# EAGLE design relaxbox (EAGLE 6.4)
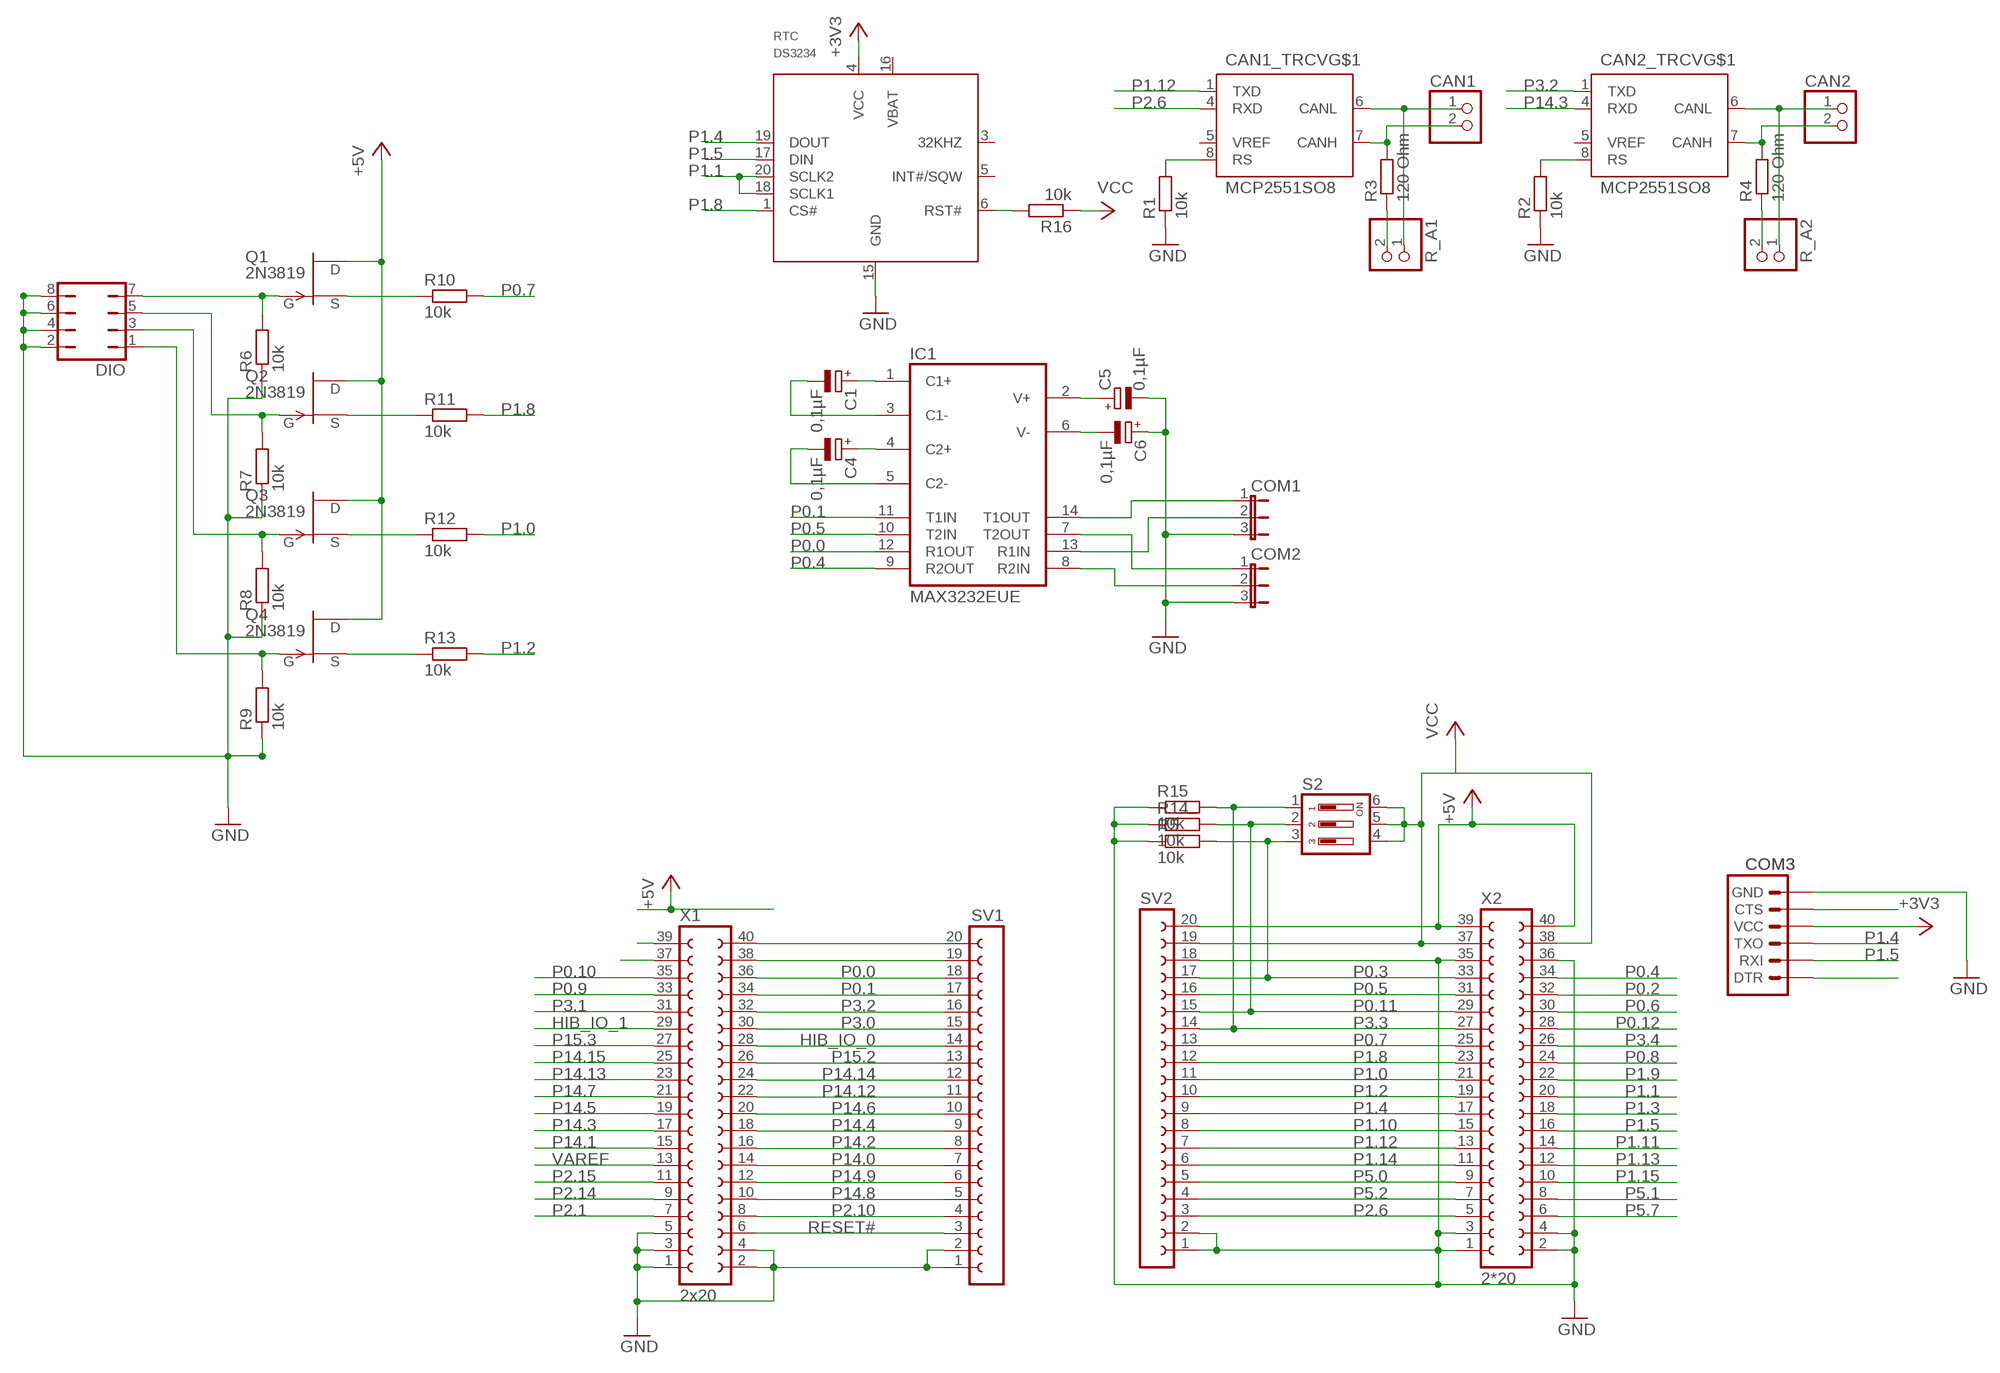
[diagram p0: schematic, sheet 1]

## Parts
C1  0,1µF  CPOL-EUE2.5-5  [E2,5-5]
C4  0,1µF  CPOL-EUE2.5-5  [E2,5-5]
C5  0,1µF  CPOL-EUE2.5-5  [E2,5-5]
C6  0,1µF  CPOL-EUE2.5-5  [E2,5-5]
CAN1  PINHD-1X2  [1X02]
CAN1_TRCV  MCP2551SO8  [SO08]
CAN2  PINHD-1X2  [1X02]
CAN2_TRCV  MCP2551SO8  [SO08]
COM1  JP2E  [JP2]
COM2  JP2E  [JP2]
COM3  SPARKFUN_ARDUINO_SERIAL_PROGRAMPTH  [SPARKFUN_1X06]
DIO  JP4Q  [JP4Q]
IC1  MAX3232EUE  [TSSOP16]
Q1  2N3819  [TO92]
Q2  2N3819  [TO92]
Q3  2N3819  [TO92]
Q4  2N3819  [TO92]
R1  10k  R-EU_M0805  [M0805]
R2  10k  R-EU_M0805  [M0805]
R3  120 Ohm  R-EU_M0805  [M0805]
R4  120 Ohm  R-EU_M0805  [M0805]
R5  10k  R-EU_M0805  [M0805]
R6  10k  R-EU_M0805  [M0805]
R7  10k  R-EU_M0805  [M0805]
R8  10k  R-EU_M0805  [M0805]
R9  10k  R-EU_M0805  [M0805]
R10  10k  R-EU_M0805  [M0805]
R11  10k  R-EU_M0805  [M0805]
R12  10k  R-EU_M0805  [M0805]
R13  10k  R-EU_M0805  [M0805]
R14  10k  R-EU_M0805  [M0805]
R15  10k  R-EU_M0805  [M0805]
R16  10k  R-EU_M0805  [M0805]
R_A1  PINHD-1X2  [1X02]
R_A2  PINHD-1X2  [1X02]
RTC  DS3234  [SO-20DW]
S2  DIP03YL  [DIP03YL]
SV1  FE20-1  [FE20]
SV2  FE20-1  [FE20]
X1  2x20  FE20-2  [FE20-2]
X2  2*20  FE20-2  [FE20-2]

## Nets
+3V3: COM3.4(VCC) RTC.4(VCC)
+5V: Q1.1(D) Q2.1(D) Q3.1(D) Q4.1(D) SV2.20 X2.39 X2.40
CANH1: CAN1.2 CAN1_TRCV.7(CANH) R3.2
CANH2: CAN2.2 CAN2_TRCV.7(CANH) R4.2
CANL1: CAN1.1 CAN1_TRCV.6(CANL) R_A1.1
CANL2: CAN2.1 CAN2_TRCV.6(CANL) R_A2.1
GND: C5.- C6.+ COM1.3 COM2.3 COM3.6(GND) DIO.2 DIO.4 DIO.6 DIO.8 R1.1 R2.1 R5.1 R6.1 R7.1 R8.1 R9.1 R14.1 R15.1 RTC.15(GND) SV1.1 SV1.2 SV2.1 SV2.2 SV2.18 X1.1 X1.2 X1.3 X1.4 X1.5 X2.1 X2.2 X2.3 X2.4 X2.35 X2.36
HIB_IO_0: SV1.14 X1.28
HIB_IO_1: X1.29
N$1: X1.39
N$2: SV1.20 X1.40
N$3: SV1.19 X1.38
N$4: X1.37
N$5: C1.+ IC1.1(C1+)
N$6: C1.- IC1.3(C1-)
N$7: COM3.5(CTS)
N$8: R16.2 RTC.6(RST#)
N$10: COM3.1(DTR)
N$11: C4.+ IC1.4(C2+)
N$12: C4.- IC1.5(C2-)
N$13: CAN1_TRCV.8(RS) R1.2
N$14: CAN2_TRCV.8(RS) R2.2
N$15: C5.+ IC1.2(V+)
N$16: C6.- IC1.6(V-)
N$19: R3.1 R_A1.2
N$20: R4.1 R_A2.2
N$25: DIO.7 Q1.2(G) R6.2
N$26: Q1.3(S) R10.1
N$28: DIO.1 Q4.2(G) R9.2
N$29: DIO.3 Q3.2(G) R8.2
N$30: DIO.5 Q2.2(G) R7.2
N$31: Q2.3(S) R11.1
N$33: Q3.3(S) R12.1
N$35: Q4.3(S) R13.1
N$37: COM1.1 IC1.14(T1OUT)
N$38: COM1.2 IC1.13(R1IN)
N$39: COM2.1 IC1.7(T2OUT)
N$40: COM2.2 IC1.8(R2IN)
P0.0: IC1.12(R1OUT) SV1.18 X1.36
P0.1: IC1.11(T1IN) SV1.17 X1.34
P0.2: X2.32
P0.3: R5.2 S2.3 SV2.17 X2.33
P0.4: IC1.9(R2OUT) X2.34
P0.5: IC1.10(T2IN) SV2.16 X2.31
P0.6: X2.30
P0.7: R10.2 SV2.13 X2.25
P0.8: X2.24
P0.9: X1.33
P0.10: X1.35
P0.11: R14.2 S2.2 SV2.15 X2.29
P0.12: X2.28
P1.0: R12.2 SV2.11 X2.21
P1.1: RTC.18(SCLK1) RTC.20(SCLK2) X2.20
P1.2: R13.2 SV2.10 X2.19
P1.3: X2.18
P1.4: COM3.3(TXO) RTC.19(DOUT) SV2.9 X2.17
P1.5: COM3.2(RXI) RTC.17(DIN) X2.16
P1.8: R11.2 RTC.1(CS#) SV2.12 X2.23
P1.9: X2.22
P1.10: SV2.8 X2.15
P1.11: X2.14
P1.12: CAN1_TRCV.1(TXD) SV2.7 X2.13
P1.13: X2.12
P1.14: SV2.6 X2.11
P1.15: X2.10
P2.1: X1.7
P2.6: CAN1_TRCV.4(RXD) SV2.3 X2.5
P2.10: SV1.4 X1.8
P2.14: X1.9
P2.15: X1.11
P3.0: SV1.15 X1.30
P3.1: X1.31
P3.2: CAN2_TRCV.1(TXD) SV1.16 X1.32
P3.3: R15.2 S2.1 SV2.14 X2.27
P3.4: X2.26
P5.0: SV2.5 X2.9
P5.1: X2.8
P5.2: SV2.4 X2.7
P5.7: X2.6
P14.0: SV1.7 X1.14
P14.1: X1.15
P14.2: SV1.8 X1.16
P14.3: CAN2_TRCV.4(RXD) X1.17
P14.4: SV1.9 X1.18
P14.5: X1.19
P14.6: SV1.10 X1.20
P14.7: X1.21
P14.8: SV1.5 X1.10
P14.9: SV1.6 X1.12
P14.12: SV1.11 X1.22
P14.13: X1.23
P14.14: SV1.12 X1.24
P14.15: X1.25
P15.2: SV1.13 X1.26
P15.3: X1.27
RESET#: SV1.3 X1.6
VAREF: X1.13
VCC: R16.1 S2.4 S2.5 S2.6 SV2.19 X2.37 X2.38
Unconnected: CAN1_TRCV.5(VREF) CAN2_TRCV.5(VREF) RTC.3(32KHZ) RTC.5(INT#/SQW) RTC.16(VBAT)

## Power pins joined to a net without a drawn wire
GND: CAN1_TRCV.2(GND) CAN2_TRCV.2(GND) IC1.15(GND)
VCC: CAN1_TRCV.3(VCC) CAN2_TRCV.3(VCC) IC1.16(VCC)

## Library data of the parts
C1 C4-C6 = rcl:CPOL-EU: POLARIZED CAPACITOR, European symbol
CAN1 CAN2 R_A1 R_A2 = pinhead:PINHD-1X2: PIN HEADER
CAN1_TRCV CAN2_TRCV = can:MCP2551: CAN Tranceiver Microchip
COM1 COM2 = jumper:JP2E: JUMPER
COM3 = ArduinoBluetoothMatev13:SPARKFUN_ARDUINO_SERIAL_PROGRAM
DIO = jumper:JP4Q: JUMPER
IC1 = maxim:MAX3232*: True RS-232 Transceivers 3.0V to 5.5V, Low-Power up to 1Mbps, Using Four 0.1µF External Capacitors Source: http://pdfserv.maxim-ic.com/en/ds/MAX3222-MAX3241.pdf; MF: MAXIM; MPN: MAX3232EUE+; OC_FARNELL: 1379769; OC_NEWARK: 68K4632
Q1-Q4 = transistor-fet:2N3819: N-Channel Junction FET
R1-R16 = rcl:R-EU_: RESISTOR, European symbol
RTC = ds3234:DS3234*: Extremely Accurate SPI Bus RTC with Integrated Crystal and SRAM The DS3234 is a low-cost, extremely accurate SPI? bus real-time clock (RTC) with an integrated temperature-com- pensated crystal oscillator (TCXO) and crystal. The DS3234 incorporates a precision, temperature-compen- sated voltage reference and comparator circuit to monitor VCC. When VCCdrops below the power-fail voltage (VPF), the device asserts the RSToutput and also disables read and write access to the part when VCCdrops below both VPFand VBAT. The RSTpin is monitored as a pushbutton input for generating a µP reset. The device switches to the backup supply input and maintains accurate timekeeping when main power to the device is interrupted. The integra- tion of the crystal resonator enhances the long-term accu- racy of the device as well as reduces the piece-part count in a manufacturing line. The DS3234 is available in com- mercial and industrial temperature ranges, and is offered in an industry-standard 300-mil, 20-pin SO package. The DS3234 also integrates 256 bytes of battery-backed SRAM. In the event of main power loss, the contents of the memory are maintained by the power source con- nected to the VBATpin. The RTC maintains seconds, minutes, hours, day, date, month, and year information. The date at the end of the month is automatically adjust- ed for months with fewer than 31 days, including correc- tions for leap year. The clock operates in either the 24-hour or 12-hour format with AM/PM indicator. Two programmable time-of-day alarms and a programmable square-wave output are provided. Address and data are transferred serially by an SPI bidirectional bus. Accuracy ±2ppm from 0°C to +40°C Accuracy ±3.5ppm from -40°C to +85°C Battery Backup Input for Continuous Timekeeping Operating Temperature Ranges Commercial: 0°C to +70°C Industrial: -40°C to +85°C Low-Power Consumption Real-Time Clock Counts Seconds, Minutes, Hours, Day, Date, Month, and Year with Leap Year Compensation Valid Up to 2099 Two Time-of-Day Alarms Programmable Square-Wave Output 4MHz SPI Bus Supports Modes 1 and 3 Digital Temp Sensor Output: ±3°C Accuracy Register for Aging Trim RSTInput/Output 300-Mil, 20-Pin SO Package Underwriters Laboratories (UL®) Recognized
S2 = switch-dil:DIP03YL: DIL/CODE SWITCH; OC_FARNELL: unknown; OC_NEWARK: unknown
SV1 SV2 = con-lsta:FE20-1: FEMALE HEADER; OC_FARNELL: unknown; OC_NEWARK: unknown
X1 X2 = con-lsta:FE20-2: FEMALE HEADER; OC_FARNELL: unknown; OC_NEWARK: unknown

## Board
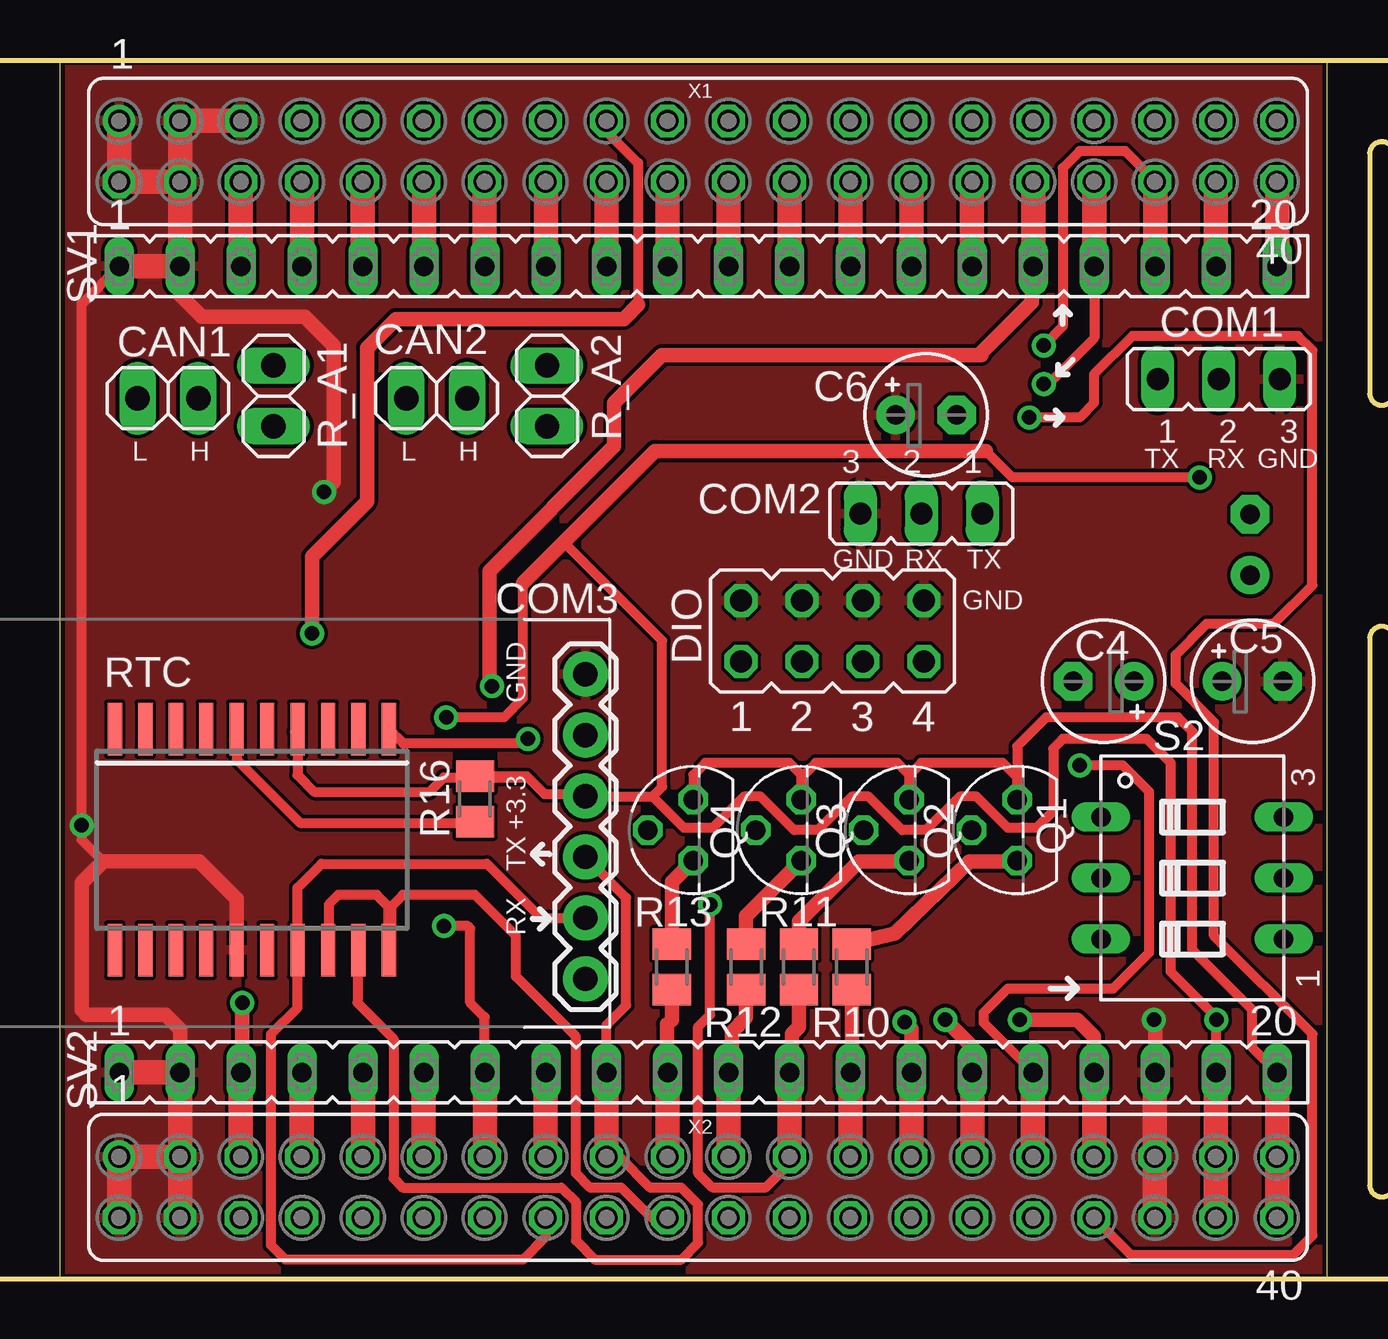
[diagram p1: board, top side]
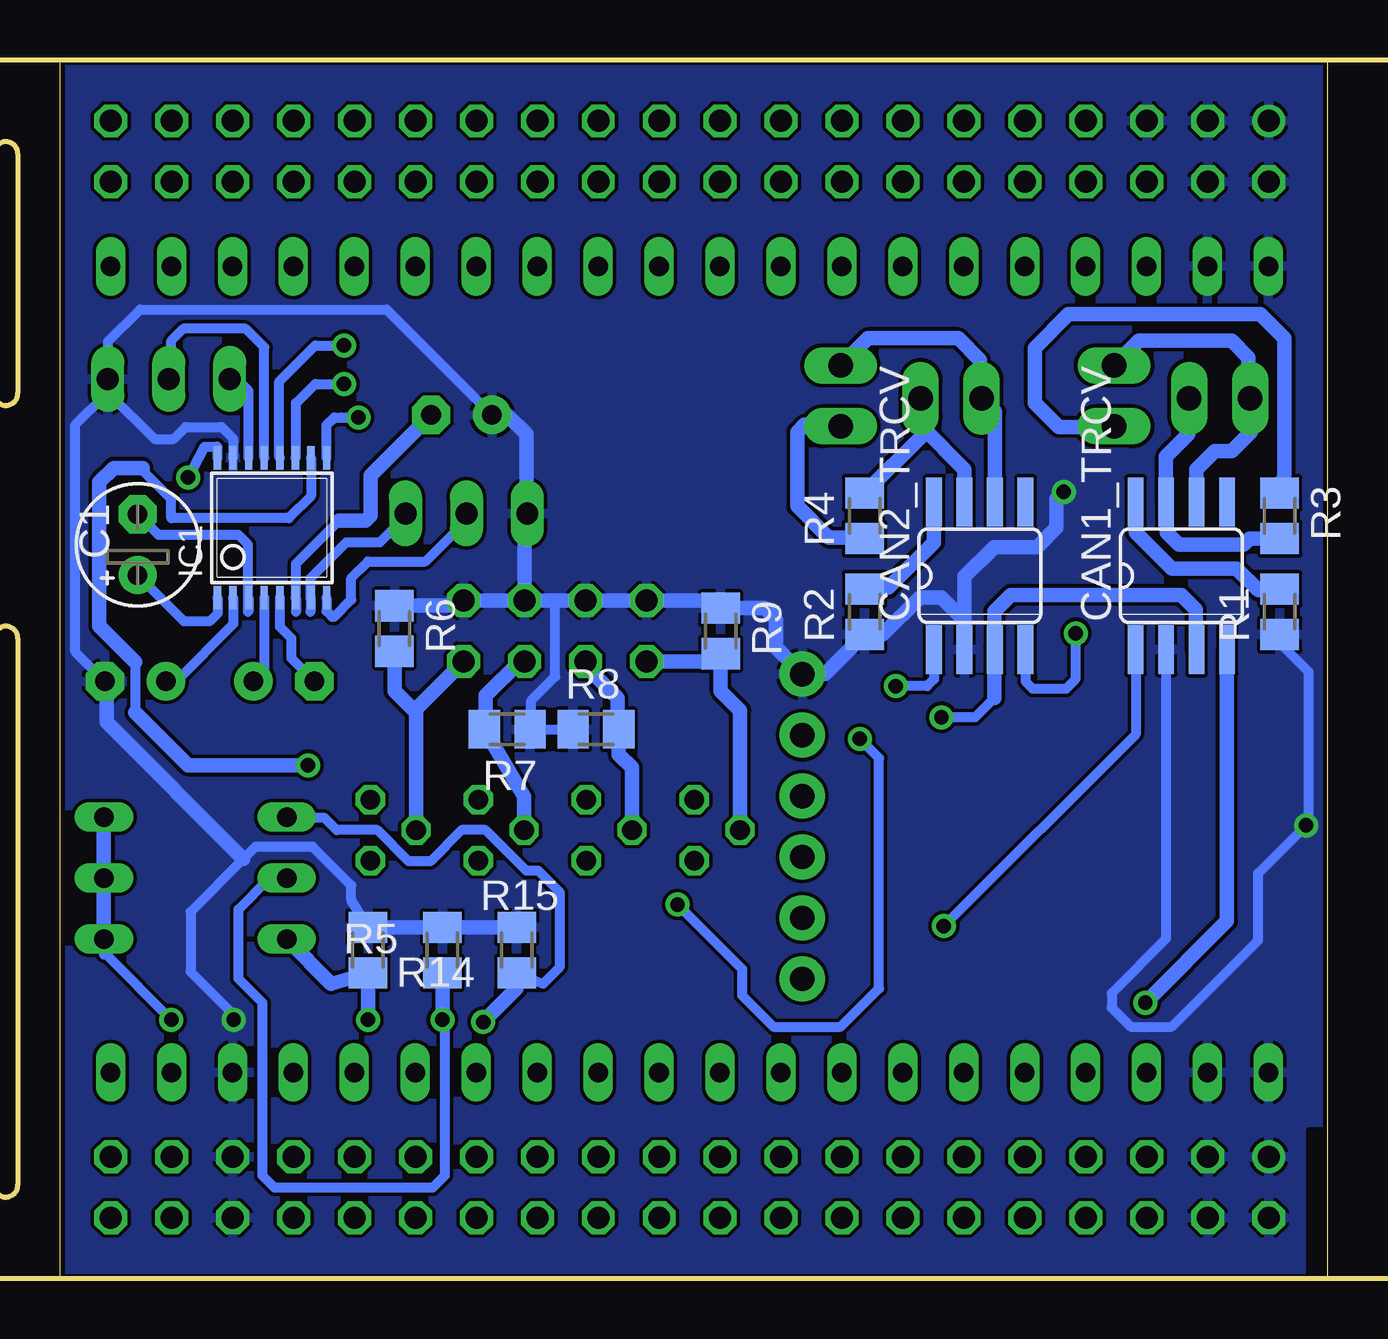
[diagram p2: board, bottom side, seen from below]

Size 52.82 x 50.8 mm. Coordinates in mm from the lower left corner, seen from the top.
Outline: 0,0 52.82,0 52.82,50.8 0,50.8 0,0
Copper layers (1*16): Top 0.035mm / dielectric 1.5mm / Bottom 0.035mm
Design rules "platinensammler_02": minimum track width 0.15mm, minimum drill 0.3mm, track to track 0.15mm, track to pad 0.15mm, pad to pad 0.15mm, via to via 0.15mm, smd to smd 0mil, copper to edge 0.2mm, drill to drill 0.2mm, minimum pad ring 0.2mm, minimum via ring 0.2mm, stop-mask expansion 4mil, vias tented up to drill 0.8mm, thermal gap 0.15mm
tRestrict: 4 lines
bRestrict: 6 lines
Milling: 12 lines

### Footprints (pad centres in the part's own frame; a part is rotated, then mirrored left to right if it is on the bottom)
E2,5-5 = drill 0.813 pad 1.6: + -1.27,0 | drill 0.813 pad 1.6 octagon: - 1.27,0
1X02 = drill 1.016 long: 1 -1.27,0; 2 1.27,0
SO08 = smd 0.66 x 2.032: 1 -1.905,-3.073; 2 -0.635,-3.073; 3 0.635,-3.073; 4 1.905,-3.073; 5 1.905,3.073; 6 0.635,3.073; 7 -0.635,3.073; 8 -1.905,3.073
JP2 = drill 0.914 long: 1 -2.54,0; 2 0,0; 3 2.54,0
SPARKFUN_1X06 = drill 1.016 pad 1.88: 1 0,0; 2 2.54,0; 3 5.08,0; 4 7.62,0; 5 10.16,0; 6 12.7,0
JP4Q = drill 0.914 octagon: 1 -3.81,-1.27; 2 -3.81,1.27; 3 -1.27,-1.27; 4 -1.27,1.27; 5 1.27,-1.27; 6 1.27,1.27; 7 3.81,-1.27; 8 3.81,1.27
TSSOP16 = smd 0.305 x 0.991: 1 -2.275,-2.918; 2 -1.625,-2.918; 3 -0.975,-2.918; 4 -0.325,-2.918; 5 0.325,-2.918; 6 0.975,-2.918; 7 1.625,-2.918; 8 2.275,-2.918; 9 2.275,2.918; 10 1.625,2.918; 11 0.975,2.918; 12 0.325,2.918; 13 -0.325,2.918; 14 -0.975,2.918; 15 -1.625,2.918; 16 -2.275,2.918
TO92 = drill 0.813 octagon: 1 1.27,0; 2 0,1.905; 3 -1.27,0
M0805 = smd 1.3 x 1.6: 1 -0.95,0; 2 0.95,0
SO-20DW = smd 0.6 x 2.2: 1 -5.715,-4.6; 2 -4.445,-4.6; 3 -3.175,-4.6; 4 -1.905,-4.6; 5 -0.635,-4.6; 6 0.635,-4.6; 7 1.905,-4.6; 8 3.175,-4.6; 9 4.445,-4.6; 10 5.715,-4.6; 11 5.715,4.6; 12 4.445,4.6; 13 3.175,4.6; 14 1.905,4.6; 15 0.635,4.6; 16 -0.635,4.6; 17 -1.905,4.6; 18 -3.175,4.6; 19 -4.445,4.6; 20 -5.715,4.6
DIP03YL = drill 0.813 long: 1 -2.54,-3.81; 2 0,-3.81; 3 2.54,-3.81; 4 2.54,3.81; 5 0,3.81; 6 -2.54,3.81
FE20 = drill 0.813 long: 1 -24.13,0; 2 -21.59,0; 3 -19.05,0; 4 -16.51,0; 5 -13.97,0; 6 -11.43,0; 7 -8.89,0; 8 -6.35,0; 9 -3.81,0; 10 -1.27,0; 11 1.27,0; 12 3.81,0; 13 6.35,0; 14 8.89,0; 15 11.43,0; 16 13.97,0; 17 16.51,0; 18 19.05,0; 19 21.59,0; 20 24.13,0
FE20-2 = drill 0.914: 1 -24.13,1.27 | drill 0.914 octagon: 2 -24.13,-1.27; 3 -21.59,1.27; 4 -21.59,-1.27; 5 -19.05,1.27; 6 -19.05,-1.27; 7 -16.51,1.27; 8 -16.51,-1.27; 9 -13.97,1.27; 10 -13.97,-1.27; 11 -11.43,1.27; 12 -11.43,-1.27; 13 -8.89,1.27; 14 -8.89,-1.27; 15 -6.35,1.27; 16 -6.35,-1.27; 17 -3.81,1.27; 18 -3.81,-1.27; 19 -1.27,1.27; 20 -1.27,-1.27; 21 1.27,1.27; 22 1.27,-1.27; 23 3.81,1.27; 24 3.81,-1.27; 25 6.35,1.27; 26 6.35,-1.27; 27 8.89,1.27; 28 8.89,-1.27; 29 11.43,1.27; 30 11.43,-1.27; 31 13.97,1.27; 32 13.97,-1.27; 33 16.51,1.27; 34 16.51,-1.27; 35 19.05,1.27; 36 19.05,-1.27; 37 21.59,1.27; 38 21.59,-1.27; 39 24.13,1.27; 40 24.13,-1.27

### Placement (x,y rotation side)
C1  49.6,30.6 90 bottom
C4  43.5,24.9 180 top
C5  49.7,24.9 0 top
C6  36.1,36 0 top
CAN1  4.5,36.7 0 top
CAN1_TRCV  6.1,29.3 0 bottom
CAN2  15.7,36.7 0 top
CAN2_TRCV  14.5,29.3 0 bottom
COM1  48.3,37.5 0 top
COM2  35.9,31.9 180 top
COM3  21.9,12.5 90 top
DIO  32.2,27 0 top
IC1  44,31.3 0 bottom
Q1  39.9,18.7 90 top
Q2  35.4,18.7 90 top
Q3  30.9,18.7 90 top
Q4  26.4,18.7 90 top
R1  2,27.8 90 bottom
R2  19.3,27.8 90 bottom
R3  2,31.8 270 bottom
R4  19.3,31.8 90 bottom
R5  40,13.7 270 bottom
R6  38.9,27.1 270 bottom
R7  34.2,22.9 180 bottom
R8  30.5,22.9 0 bottom
R9  25.3,27 270 bottom
R10  33,13 270 top
R11  30.8,13 270 top
R12  28.6,13 270 top
R13  25.5,13 270 top
R14  36.9,13.7 270 bottom
R15  33.8,13.7 270 bottom
R16  17.3,20 270 top
R_A1  8.9,36.8 270 top
R_A2  20.3,36.8 270 top
RTC  8,18.3 180 top
S2  47.2,16.7 270 top
SV1  26.6,42.2 0 top
SV2  26.6,8.6 0 top
X1  26.59,46.99 0 top
X2  26.59,3.81 0 top

### Tracks (layer width: path | path; a pad name or v marks a point on that pad's centre or on a via)
+3V3
  Top 0.406: 9.8,22.8 RTC.4 9.91,21 10.6,20.3 15.4,20.3 16,20.9 19.4,20.9 19.45,20.95 20.2,20.2 21.82,20.2 COM3.4 21.92,20.1
+5V
  Top 0.406: SV2.20 49.7,9.63 49.7,11.2 47.2,13.7 47.2,22.8 46.6,23.4 41.1,23.4 39.9,22.2 Q1.1 39.9,20.9 39.3,21.5 35.9,21.5 35.4,21 | Q2.1 35.4,21 | 35.4,21 34.9,21.5 31.5,21.5 30.9,20.9 | Q3.1 30.9,20.9 | 30.9,20.9 30.9,21 30.4,21.5 26.9,21.5 26.4,21 Q4.1
  Top 0.61: 40.23,19.97 Q1.1
  Top 1.016: SV2.20 X2.39 | X2.39 | X2.39 X2.40
CANH1
  Bottom 0.61: CAN1.2 5.8,36.67 5.8,35.2 6.74,34.27 CAN1_TRCV.7 6.7,32.34 6.7,31.1 6.2,30.6 3.5,30.6 3.25,30.85 R3.2
CANH2
  Bottom 0.61: CAN2_TRCV.7 15.13,33.73 16.9,35.5 | 16.9,35.5 16.9,36.63 CAN2.2 | 16.9,35.5 16.9,35.15 R4.2
CANL1
  Bottom 0.406: 3.3,36.77 CAN1.1
  Bottom 0.61: CAN1_TRCV.6 5.46,33.73 4.7,34.5 4,34.5 3.2,35.3 3.2,36.67 CAN1.1 | 3.3,36.77 3.3,38.4 4,39.1 7.87,39.1 R_A1.1
CANL2
  Bottom 0.406: 14.5,36.77 CAN2.1 14.4,36.67
  Bottom 0.61: 14.5,36.77 14.5,38.3 15.4,39.2 19.17,39.2 R_A2.1 | CAN2_TRCV.6 13.87,36.13 CAN2.1
GND  (via drill 0.6)
  Top 0.406: 45.65,10.75 v45.6,10.8 | SV2.2 | SV1.2 | 1.8,17.4 1.7,17.4 | 1.8,17.4 2,17.4 | 1.8,17.4 0.9,18.3 v0.9,18.9 0.9,40.63 SV1.1
  Top 0.61: SV2.18 45.65,10.75 | SV2.2 5,10.4 4.4,11 1.1,11 0.9,11.2 0.9,16.5 1.8,17.4 5.8,17.4 7.37,15.84 RTC.15 | SV1.2 5,41 5.9,40.1 10.2,40.1 11.4,38.9 11.4,33.2 v11,32.8
  Top 1.016: SV1.1 SV1.2 X1.4 | X1.4 X1.2 X1.1 | X1.4 X1.3 X1.5 | X2.3 X2.1 X2.2 | X2.3 X2.4 | X2.3 SV2.2 SV2.1 | X2.36 X2.35 SV2.18
  Bottom 0.406: CAN1_TRCV.2 6.8,26.16 | 33.4,31.94 COM2.3 33.47,31.79 | R8.1 R7.1 33.2,22.95 33.2,24.1 32.2,25.1 32.2,28.27 | 25.43,28.27 R9.1 | R5.1 40.7,15.8 40.7,16.4 42.3,18 44.7,18 45.2,17.5 47.4,15.3 47.4,12.8 45.6,11 v45.6,10.8 | C6.+ 39.23,40.4 49.5,40.4 50.84,39.06 COM1.3 50.8,37.46 50.8,36.9 | R2.1 18.55,26.85 | 15.2,27.5 15.2,26.29 CAN2_TRCV.2 | 6.8,26.29 CAN1_TRCV.2 | 2.35,26.85 R1.1 2,26.5 | 50.9,24.7 C5.- 52.2,26.13 52.2,35.6 50.9,36.9 50.8,36.9 | IC1.15 45.63,35.02 46.1,35.5 47.6,35.5 48.1,35 48.9,35 50.8,36.9 | 2,26.5 0.8,25.3 0.8,19 v0.9,18.9 2.9,16.9 2.9,14.1 6.5,10.5 8.2,10.5 9,11.3 9,11.9 6.74,14.16 CAN1_TRCV.2 | 2.45,26.85 2.35,26.85 | 2.35,26.85 2,26.5
  Bottom 0.61: C6.+ 34.2,36 33.4,35.2 33.4,31.94 | DIO.6 DIO.8 36.23,28.05 R6.1 | DIO.6 32.2,28.27 DIO.4 DIO.2 25.43,28.27 | R15.1 R14.1 R5.1 | DIO.6 33.47,31.79 | 18.55,26.85 17,28.4 16.1,28.4 15.2,27.5 | CAN2_TRCV.2 15.13,29.27 13.9,30.5 12.1,30.5 11.3,31.3 11.3,32.5 v11,32.8 | 50.9,24.7 50.9,23.2 45.2,17.5 | R2.1 20.95,25.2 COM3.6 23,26.3 23,27.5 23.45,27.95 R9.1
  pour Bottom: -0.1,50.9 -0.1,-0.3 53,-0.3 53,50.9
  pour Top: -0.1,50.9 -0.1,-0.3 53,-0.3 53,50.9
HIB_IO_0
  Top 1.016: SV1.14 X1.28
N$2
  Top 1.016: SV1.20 X1.40
N$3
  Top 1.016: X1.38 SV1.19
N$5
  Bottom 0.406: IC1.1 46.27,27.73 46.6,27.4 47.67,27.4 C1.+
N$6
  Bottom 0.406: IC1.3 44.98,27.82 45,27.8 45,30.6 45.4,31 48.73,31 C1.-
N$8
  Top 0.406: RTC.6 7.37,21.64 10,19 17.25,19 R16.2
N$11
  Bottom 0.406: IC1.4 44.32,25.34 C4.+
N$12
  Bottom 0.406: IC1.5 43.68,27.18 43.2,26.7 43.2,25.87 C4.-
N$13
  Bottom 0.406: R1.2 2.05,28.7 2.7,28.7 | 8.01,31.5 CAN1_TRCV.8
  Bottom 0.61: 2.7,28.7 2.9,28.7 3.8,29.6 6.5,29.6 8.01,31.11 8.01,31.5
N$14
  Bottom 0.406: 19.25,28.8 R2.2
  Bottom 0.61: CAN2_TRCV.8 16.41,30.7 18.3,28.8 19.25,28.8
N$15
  Bottom 0.406: C5.+ 48,24.9 45.6,27.3 45.6,28.36 IC1.2
N$16
  Bottom 0.406: IC1.6 43,28.36 | 43,28.36 43,27.8 | 43,28.36 43,29.8 41.2,31.6
  Bottom 0.61: 41.2,31.6 40.1,31.6 39.9,31.8 39.9,33.47 C6.-
N$19
  Bottom 0.406: 1.8,33.5 2,33.3 R3.1
  Bottom 0.61: 1.8,33.5 1.8,39.2 2.8,40.2 10.8,40.2 12.2,38.8 12.2,36.5 11.2,35.5 8.93,35.5 R_A1.2
N$20
  Bottom 0.406: 19.35,30.9 R4.1 | 20.37,35.6 R_A2.2
  Bottom 0.61: 19.35,30.9 20.8,30.9 22.1,32.2 22.1,35.3 21.8,35.6 20.37,35.6
N$25
  Bottom 0.61: Q1.2 38,23.59 38.2,23.8 | 38.2,23.8 38.9,24.5 R6.2 | DIO.7 37.94,23.8 38.2,23.8
N$26
  Top 0.406: 39.87,17.4 Q1.3
  Top 0.61: R10.1 34.8,14.4 37.9,17.4 39.87,17.4
N$28
  Bottom 0.406: 25.43,25.73 R9.2
  Bottom 0.61: DIO.1 25.43,25.73 | Q4.2 24.5,23.7 25.3,24.5 R9.2
N$29
  Bottom 0.61: 30.7,25.7 30.9,25.7 DIO.3 30.93,25.53 29.6,24.2 29.6,22.95 R8.2 29.55,21.85 29,21.3 Q3.2
N$30
  Bottom 0.61: Q2.2 33.5,20.09 R7.2 35.1,22.95 35.1,24.3 33.67,25.73 DIO.5
N$31
  Top 0.61: R11.1 30.8,14.9 33.3,17.4 35.37,17.4 Q2.3
N$33
  Top 0.406: 30.87,17.4 Q3.3
  Top 0.61: R12.1 28.6,15.13 Q3.3
N$35
  Top 0.61: R13.1 25.5,16.53 Q4.3
N$37
  Bottom 0.406: IC1.14 44.98,37.02 45.46,37.5 COM1.1
N$38
  Bottom 0.406: IC1.13 44.32,38.83 45.1,39.6 47.7,39.6 48.2,39.1 48.2,37.6 COM1.2
N$39
  Bottom 0.406: IC1.7 42.4,28.36 | 42.4,28.36 42.4,27.8 | 42.4,28.36 42.4,29.2 40.9,30.7 39.5,30.7 38.44,31.76 COM2.1
N$40
  Bottom 0.406: IC1.8 41.73,27.82 41.5,27.6 41.4,27.6 40.7,28.3 40.7,29.2 40,29.9 37.6,29.9 35.9,31.6 COM2.2
P0.0  (via drill 0.6)
  Top 0.406: SV1.18 45.65,45.65 45.5,45.8 45.5,45.9 44.4,47 42.5,47 41.8,46.3 41.8,39.7 v41,38.9
  Top 1.016: SV1.18 X1.36
  Bottom 0.406: IC1.12 43.7,34.24 43.7,37.4 42.2,38.9 v41,38.9
P0.1  (via drill 0.6)
  Top 0.406: SV1.17 43.11,39.21 41.2,37.3 v41,37.3
  Top 1.016: X1.34 SV1.17
  Bottom 0.406: IC1.11 43,34.24 43,36.5 42.2,37.3 v41,37.3
P0.3  (via drill 0.6)
  Top 0.406: SV2.17
  Top 0.61: v40,10.8 42.4,10.8 43.1,10.1 SV2.17
  Top 1.016: SV2.17 X2.33
  Bottom 0.61: v40,10.8 R5.2 41.53,12.3 S2.3
P0.4  (via drill 0.6)
  Top 0.406: X2.34 44.64,1 51.4,1 52.2,1.8 52.2,10.2 48.1,14.3 48.1,23.2 46.5,24.8 46.5,26 47.8,27.3 50.6,27.3 52.2,28.9 52.2,38.7 51.6,39.3 44.7,39.3 43.1,37.7 43.1,36.5 42.5,35.9 v40.4,35.9
  Bottom 0.406: v40.4,35.9 40.9,35.9 41.1,35.9 41.4,35.9 41.73,35.58 IC1.9
P0.5  (via drill 0.6)
  Top 0.406: SV2.16 38.5,10.67 38.5,11.1 39.5,12.1 43.9,12.1 45.4,13.6 45.4,20.3 44.3,21.4 v42.5,21.4
  Top 1.016: X2.31 SV2.16
  Bottom 0.406: 49.7,25.7 49.7,23.6 | 49.4,33.8 49.3,33.8 49.3,33.6 48.2,32.5 48.2,31.7 43.3,31.7 42.38,32.62 IC1.10
  Bottom 0.61: 49.4,33.8 50.6,33.8 51.2,33.2 51.2,27.2 49.7,25.7 | 49.7,23.6 47.5,21.4 v42.5,21.4
P0.7
  Top 0.61: 33,8.65 R10.2
  Top 0.813: SV2.13 33,8.65
  Top 1.016: SV2.13 X2.25
P0.11  (via drill 0.6)
  Top 0.406: 38.03,9.67 SV2.15
  Top 0.61: v36.9,10.8 38.03,9.67
  Top 1.016: SV2.15 X2.29
  Bottom 0.406: R14.2 36.8,12.65 36.8,4.3 37.3,3.8 43.9,3.8 44.4,4.3 44.4,11.5 45.4,12.5 45.4,15.4 44.1,16.7 S2.2
  Bottom 0.61: R14.2 v36.9,10.8
P1.0
  Top 0.61: 28,8.73 28,10.3 28.6,10.9 R12.2
  Top 0.813: SV2.11 28,8.73
  Top 1.016: SV2.11 X2.21
P1.1
  Top 0.406: X2.20 24.66,2.54 23.4,3.8 22.1,3.8 21.5,4.4 21.5,10.1 19,12.6 19,14.3 17.3,16 14.3,16 13.8,15.5 13.8,13.79 RTC.20 13.7,13.69 13.7,15.5 13.2,16 11.6,16 11.2,15.6 11.2,13.72 RTC.18
P1.2
  Top 0.61: R13.2 25.5,10.8 25.3,10.6 25.3,8.63 SV2.10
  Top 1.016: X2.19 SV2.10
P1.4
  Top 0.406: 12.4,13.74 RTC.19 12.4,13.65 12.4,11.5 13.9,10 13.9,4.2 14.3,3.8 20.9,3.8 21.5,3.2 21.5,1.6 22.3,0.8 25.9,0.8 26.6,1.5 26.6,3.1 25.9,3.8 24.6,3.8 23.32,5.08 X2.17 | SV2.9 22.79,10.59 23.6,11.4 23.6,15.88 COM3.3
  Top 1.016: SV2.9 X2.17
P1.5
  Top 0.406: X2.16 20.24,1.74 19.3,0.8 9.4,0.8 8.8,1.4 8.8,10.2 9.9,11.3 RTC.17 9.9,16.3 10.9,17.3 17.8,17.3 20.06,15.04 COM3.2
P1.8  (via drill 0.6)
  Top 0.406: v19.5,22.5 19.3,22.3 14.32,22.3 RTC.1 | X2.23 30.4,4.8 29.4,3.8 27.2,3.8 26.6,4.4 26.6,10.5 27.1,11 v27.1,15.6
  Top 0.61: 30.5,8.69 30.5,10.2 30.8,10.5 R11.2
  Top 0.813: SV2.12 30.5,8.69
  Top 1.016: X2.23 SV2.12
  Bottom 0.406: v19.5,22.5 18.7,21.7 18.7,12.1 20.3,10.5 23.1,10.5 24.4,11.8 24.4,12.9 v27.1,15.6
P1.10
  Top 1.016: X2.15 SV2.8
P1.12  (via drill 0.6)
  Top 0.406: SV2.7 17.71,9.89 17.7,9.9 17.7,10.9 17.1,11.5 17.1,14.6 17,14.7 v16,14.7
  Top 1.016: SV2.7 X2.13
  Bottom 0.406: CAN1_TRCV.1 8.01,22.7 v16,14.7
P1.14
  Top 1.016: X2.11 SV2.6
P2.6  (via drill 0.6)
  Top 0.406: SV2.3 7.6,8.65 | v7.6,11.5 7.6,11
  Top 0.61: 7.6,8.65 v7.6,11.5
  Top 1.016: X2.5 SV2.3
  Bottom 0.61: v7.6,11.5 4.2,14.9 CAN1_TRCV.4
P2.10
  Top 1.016: SV1.4 X1.8
P3.0
  Top 1.016: X1.30 SV1.15
P3.2  (via drill 0.6)
  Top 0.61: SV1.16 40.5,42.13 40.5,40.7 38.4,38.6 38.4,38.5 25.1,38.5 23.1,36.5 23.1,34.7 17.9,29.5 17.9,24.8 v18,24.7
  Top 1.016: SV1.16 X1.32
  Bottom 0.406: CAN2_TRCV.1 16.41,25 16.7,24.7 v18,24.7
P3.3  (via drill 0.6)
  Top 0.61: v35.2,10.7 35.49,10.41 SV2.14
  Top 1.016: X2.27 SV2.14
  Bottom 0.406: 33.8,12.1 R15.2 32.7,12.3 32,13 32,16.1 32.9,17 33.4,17 35.1,18.7 36.1,18.7 37.4,17.4 38.3,17.4 39.6,18.7 41.3,18.7 41.8,19.2 43.35,19.2 S2.1
  Bottom 0.61: 33.8,12.1 v35.2,10.7
P5.0
  Top 1.016: SV2.5 X2.9
P5.2
  Top 1.016: X2.7 SV2.4
P14.0
  Top 1.016: X1.14 SV1.7
P14.2
  Top 1.016: SV1.8 X1.16
P14.3  (via drill 0.6)
  Top 0.406: X1.17 22.78,47.82 24.1,46.5 24.1,40.6
  Top 0.61: 24.1,40.6 23.5,40 14,40 12.8,38.8 12.8,32.4 10.5,30.1 v10.5,26.9
  Bottom 0.406: CAN2_TRCV.4 12.59,24.89 12.3,24.6 10.9,24.6 10.5,25 v10.5,26.9
P14.4
  Top 1.016: X1.18 SV1.9
P14.6
  Top 1.016: SV1.10 X1.20
P14.8
  Top 1.016: X1.10 SV1.5
P14.9
  Top 1.016: SV1.6 X1.12
P14.12
  Top 1.016: SV1.11 X1.22
P14.14
  Top 1.016: X1.24 SV1.12
P15.2
  Top 1.016: X1.26 SV1.13
RESET#
  Top 1.016: X1.6 SV1.3
VCC  (via drill 0.6)
  Top 0.406: v16.1,23.4 18.5,23.4 19.3,24.2 19.3,29 19.4,29 21.1,30.7 21.1,30.6 25.1,26.6 25.1,20.5 24.7,20.1 | v47.5,33.4 39.7,33.4 38.6,34.5 | SV2.19 v48.19,10.79 v48.2,10.8 48.2,10.9 46.3,12.8 46.3,21.5 45.3,22.5 41.8,22.5 41.4,22.1 41.4,19.5 40.7,18.8 39.5,18.8 38.2,20.1 37.5,20.1 36.1,18.7 35.1,18.7 33.7,20.1 33,20.1 31.6,18.7 30.6,18.7 29.2,20.1 28.5,20.1 27.2,18.8 26,18.8 24.7,20.1 | R16.1 19.35,20.95 19.4,20.9 19.5,20.9 20.2,20.2 21.8,20.2 21.9,20.1 24.7,20.1
  Top 0.61: 38.6,34.5 24.8,34.5 19.3,29
  Top 1.016: X2.38 X2.37 SV2.19
  Bottom 0.406: CAN2_TRCV.3 13.8,26.16 | 5.5,26.19 CAN1_TRCV.3 | IC1.16 46.27,34.67 | 46.27,34.67 46.3,34.7 | 13.9,24.2 14.7,23.4 v16.1,23.4 | 46.27,34.67 46.82,34.67 v47.5,33.4 | S2.4 51.01,13.51 50.91,13.51 v48.2,10.8 51,13.6 51,14.1 51.01,14.11 S2.6
  Bottom 0.61: CAN1_TRCV.3 5.5,26.23 5.5,27.9 6.1,28.5 13.2,28.5 13.9,27.8 13.9,26.26 CAN2_TRCV.3 13.9,26.19 13.9,24.2 | S2.6 S2.5 S2.4

### Text on the board
tPlace: L | H | L | H | TX | RX | GND | GND | RX | TX | GND | GND | 3 | +3.3 | TX | RX | 1
Reference: 50x 0.4mm | drills, NPTH | 9.2 mm | 50.8 mm | 47.4 mm | 36.4 mm | 27.2 mm | 3.4 mm | 75.5 mm | 98.52 mm
tSilk: 1 | X1 | 2 | 10 | 20 | 30 | Power | IC101 | 1 | 1 | Q2 | RESET | IC200 | X100 | Debug | X3 | LED2 | IC100 | X200 | IC1 | P1.0 | IC400 | BUTTON2 | Q1 | X5 | LED1 | XMC4500 Relax/Relax Lite Kit-V1 | P1.1 | BUTTON1 | www.infineon.com/xmc-dev | 9 | 19 | 29 | Q100 | X300 | 1 | X2 | 2 | 1
bSilk: GND | VDD5 | VAREF | P14.13 | P14.15 | GND | P2.1 | P2.14 | P2.15 | P14.1 | P14.3 | P14.5 | P14.7 | P15.3 | HIB_1 | P3.1 | P0.9 | P0.10 | VDD3.3 | X1 | P14.12 | P14.14 | RST# | P2.10 | P14.8 | P14.9 | P14.0 | P14.2 | P14.4 | P14.6 | P15.2 | HIB_0 | P3.0 | P3.2 | P0.1 | P0.0 | P1.14 | P1.12 | P1.10 | P0.11 | P2.6 | P5.2 | P5.0 | P1.4 | P1.2 | P1.0 | P1.8 | P0.7 | P3.3 | P0.5 | P0.3 | VDD3.3 | GND | X2 | P1.15 | P1.13 | P1.11 | P0.12 | P5.7 | P5.1 | P1.5 | P1.3 | P1.1 | P1.9 | P0.8 | P3.4 | P0.6 | P0.2 | P0.4 | VDD5 | GND